# EAGLE design v4m (EAGLE 6.2)
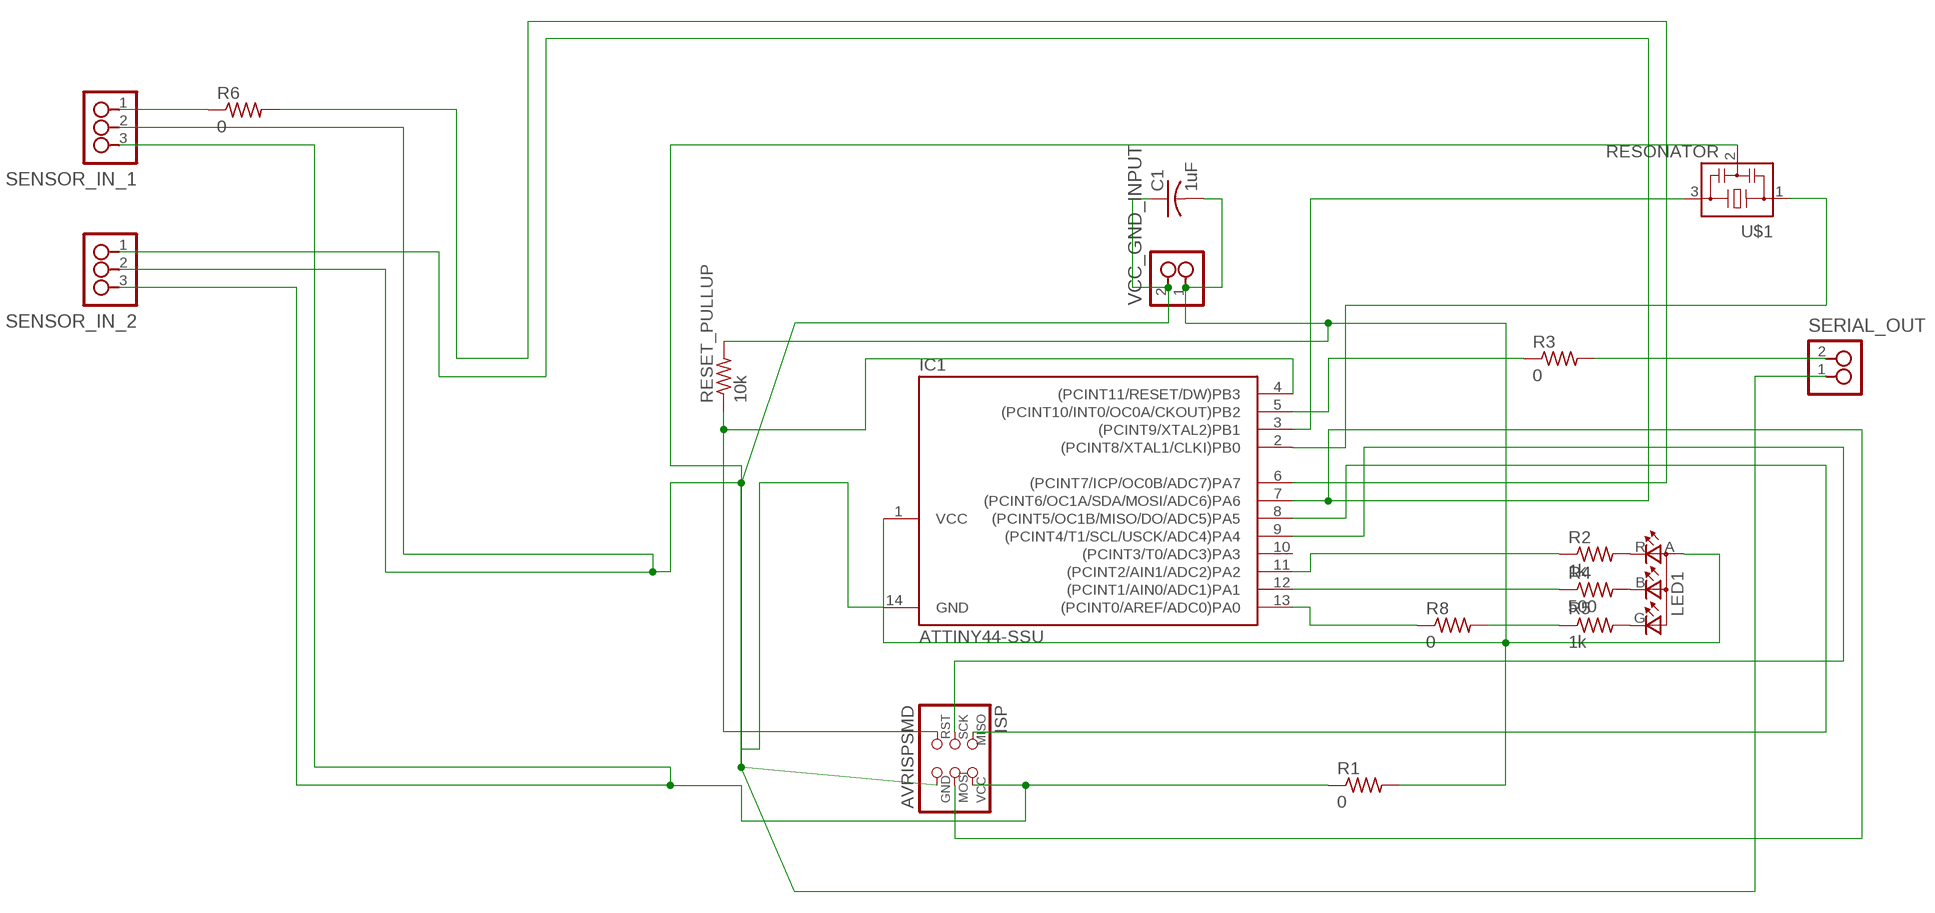
[diagram p0: schematic, sheet 1]

## Parts
C1  1uF  C-USC1206  [C1206]
IC1  ATTINY44-SSU  [SOIC14]
ISP  AVRISPSMD  [2X03SMD]
LED1  LEDRGBOLD  [P-LCC-4-3]
R1  0  RES-US1206  [R1206]
R2  1k  RES-US1206  [R1206]
R3  0  RES-US1206  [R1206]
R4  500  RES-US1206  [R1206]
R5  1k  RES-US1206  [R1206]
R6  0  RES-US1206  [R1206]
R8  0  RES-US1206  [R1206]
RESET_PULLUP  10k  R-US_R1206  [R1206]
SENSOR_IN_1  3_PIN_HEADERHEADER  [SMT_PINS_3]
SENSOR_IN_2  3_PIN_HEADERHEADER  [SMT_PINS_3]
SERIAL_OUT  2_PIN_HEADERHEADER  [SMT_PINS_2]
U$1  RESONATOR  [EFOBM]
VCC_GND_INPUT  2_PIN_HEADERHEADER  [SMT_PINS_2]

## Nets
ATTINY45: IC1.9((PCINT4/T1/SCL/USCK/ADC4)PA4) ISP.3(SCK)
N$2: C1.2 IC1.1(VCC) LED1.A(A2) R1.2 RESET_PULLUP.2 VCC_GND_INPUT.1
N$3: R5.1 R8.2
N$4: IC1.8((PCINT5/OC1B/MISO/DO/ADC5)PA5) ISP.1(MISO)
N$5: IC1.4((PCINT11/RESET/DW)PB3) ISP.5(RST) RESET_PULLUP.1
N$6: IC1.5((PCINT10/INT0/OC0A/CKOUT)PB2) R3.1
N$7: IC1.2((PCINT8/XTAL1/CLKI)PB0) U$1.1
N$8: ISP.2(VCC) R1.1 SENSOR_IN_1.3 SENSOR_IN_2.3
N$9: R6.1 SENSOR_IN_1.1
N$10: LED1.R(CRED) R2.2
N$11: LED1.B(CBLUE) R4.2
N$12: IC1.6((PCINT7/ICP/OC0B/ADC7)PA7) R6.2
N$13: IC1.3((PCINT9/XTAL2)PB1) U$1.3
N$14: LED1.G(CGREEN) R5.2
N$15: IC1.13((PCINT0/AREF/ADC0)PA0) R8.1
N$16: C1.1 IC1.14(GND) ISP.6(GND) SENSOR_IN_1.2 SENSOR_IN_2.2 SERIAL_OUT.1 U$1.2 VCC_GND_INPUT.2
N$17: IC1.11((PCINT2/AIN1/ADC2)PA2) R2.1
N$18: IC1.12((PCINT1/AIN0/ADC1)PA1) R4.1
N$19: R3.2 SERIAL_OUT.2
N$21: IC1.7((PCINT6/OC1A/SDA/MOSI/ADC6)PA6) ISP.4(MOSI) SENSOR_IN_2.1
Unconnected: IC1.10((PCINT3/T0/ADC3)PA3)

## Library data of the parts
C1 = resistor:C-US: CAPACITOR, American symbol
IC1 = fab:ATTINY44
ISP = fab:AVRISP
LED1 = fab:LEDRGBOLD: OSRAM Hyper Multi TOPLED® Hyper-Bright LED LATB T686 Source: http://www.osram.convergy.de/
R1-R6 R8 = fab:RES-US: Resistor (US Symbol) Variants with postfix FAB are widened to allow the routing of internal traces
RESET_PULLUP = resistor:R-US_: RESISTOR, American symbol
SENSOR_IN_1 SENSOR_IN_2 = ng:3_PIN_HEADER: 3 SMT pin pads
SERIAL_OUT VCC_GND_INPUT = ng:2_PIN_HEADER: 2 SMT pin pads
U$1 = fab:RESONATOR

## Board
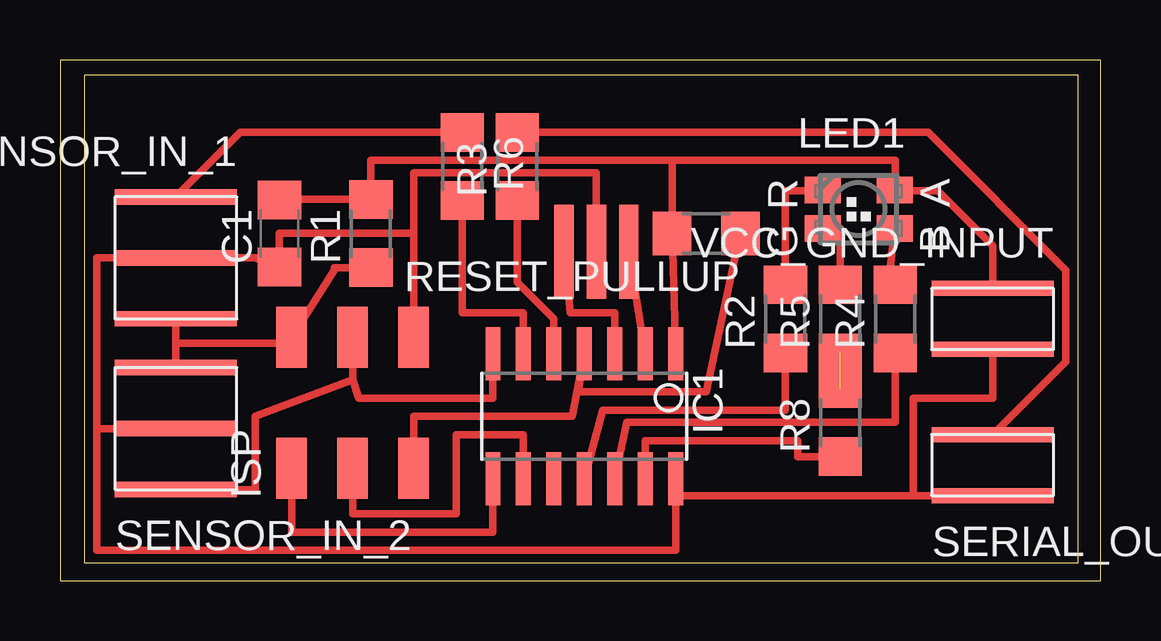
[diagram p1: board, top side]

Size 43.36 x 21.71 mm. Coordinates in mm from the lower left corner, seen from the top.
Outline: 0,0 43.36,0 43.36,21.71 0,21.71 0,0
Copper layers (1*16): Top 0.035mm / dielectric 1.5mm / Bottom 0.035mm
Design rules: minimum track width 10mil, minimum drill 24mil, track to track 8mil, track to pad 8mil, pad to pad 8mil, via to via 8mil, smd to smd 8mil, copper to edge 40mil, drill to drill 8mil, minimum pad ring 10mil, minimum via ring 8mil, stop-mask expansion 4mil, vias tented up to drill 0mil, thermal gap 10mil

### Footprints (pad centres in the part's own frame; a part is rotated, then mirrored left to right if it is on the bottom)
C1206 = smd 1.6 x 1.8: 1 -1.4,0; 2 1.4,0
SOIC14 = smd 0.61 x 2.21: 1 -3.81,-2.603; 2 -2.54,-2.603; 3 -1.27,-2.603; 4 0,-2.603; 5 1.27,-2.603; 6 2.54,-2.603; 7 3.81,-2.603; 8 3.81,2.603; 9 2.54,2.603; 10 1.27,2.603; 11 0,2.603; 12 -1.27,2.603; 13 -2.54,2.603; 14 -3.81,2.603
2X03SMD = smd 2.54 x 1.27: 1 -2.54,2.54; 2 2.92,2.54; 3 -2.54,0; 4 2.92,0; 5 -2.54,-2.54; 6 2.92,-2.54
P-LCC-4-3 = smd 1.1 x 1.5: A -0.8,1.5; B 0.8,1.5; G 0.8,-1.5; R -0.8,-1.5
R1206 = smd 1.6 x 1.803: 1 -1.422,0; 2 1.422,0
SMT_PINS_3 = smd 5.08 x 0.635: 1 0,0; 2 0,2.54; 3 0,5.08
SMT_PINS_2 = smd 5.08 x 0.635: 1 0,0; 2 0,2.54
EFOBM = smd 0.8 x 3.9: 1 -1.35,0; 2 0,0; 3 1.35,0

### Placement (x,y rotation side)
C1  9.14,14.48 90 top
IC1  21.84,6.86 180 top
ISP  12.19,7.24 90 top
LED1  33.27,15.49 270 top
R1  12.95,14.48 90 top
R2  30.23,10.92 90 top
R3  19.05,17.27 90 top
R4  34.8,10.92 90 top
R5  32.51,10.92 90 top
R6  16.76,17.27 270 top
R8  32.51,6.6 90 top
RESET_PULLUP  26.92,14.48 180 top
SENSOR_IN_1  4.83,16 180 top
SENSOR_IN_2  4.83,3.81 0 top
SERIAL_OUT  38.86,3.56 0 top
U$1  22.35,13.72 180 top
VCC_GND_INPUT  38.86,12.19 180 top

### Tracks (layer width: path | path; a pad name or v marks a point on that pad's centre or on a via)
ATTINY45
  Top 0.305: ISP.3 12.19,2.79 16.51,2.79 16.51,6.1 19.3,6.1 IC1.9
N$2
  Top 0.305: IC1.1 RESET_PULLUP.2 25.5,17.53 | 25.5,17.53 34.8,17.53 34.8,16.29 LED1.A 34.81,16.26 36.58,16.26 38.86,13.97 VCC_GND_INPUT.1 | 25.5,17.53 12.95,17.53 R1.2 9.14,15.9 C1.2
N$3  (1 unrouted)
N$4
  Top 0.305: ISP.1 9.65,2.03 18.03,2.03 IC1.8
N$5
  Top 0.305: ISP.5 14.73,6.86 21.34,6.86 IC1.4 21.59,7.87 26.92,7.87 RESET_PULLUP.1
N$6
  Top 0.305: IC1.5 20.57,10.92 19.05,12.45 R3.1
N$7
  Top 0.305: U$1.1 IC1.2
N$8
  Top 0.305: SENSOR_IN_2.3 4.83,9.91 | SENSOR_IN_1.3 4.83,9.91 | 4.83,9.91 9.14,9.91 ISP.2 11.43,12.95 11.43,13.06 R1.1
N$9
  Top 0.305: R6.1 7.52,18.69 SENSOR_IN_1.1
N$10
  Top 0.305: LED1.R 31.77,16.26 30.23,16.26 R2.2
N$11
  Top 0.305: LED1.B 34.52,12.34 R4.2
N$12
  Top 0.305: R6.2 16.76,11.18 19.3,11.18 IC1.6
N$13
  Top 0.305: U$1.3 21.26,11.18 23.11,11.18 IC1.3
N$14
  Top 0.305: R5.2 32.51,14.69 LED1.G
N$15
  Top 0.305: IC1.13 24.38,5.84 30.73,5.84 30.73,5.18 R8.1
N$16
  Top 0.305: 1.52,6.35 1.52,13.46 SENSOR_IN_1.2 8.13,13.46 C1.1 9.14,14.48 14.73,14.48 | 1.52,6.35 SENSOR_IN_2.2 | 35.56,3.56 25.65,3.56 IC1.14 25.65,1.27 1.52,1.27 1.52,6.35 | 35.56,3.56 SERIAL_OUT.1 | VCC_GND_INPUT.2 38.86,7.62 35.56,7.62 35.56,3.56 | ISP.6 14.73,14.48 | U$1.2 22.35,17.02 14.73,17.02 14.73,14.48
N$17
  Top 0.305: IC1.11 22.61,7.11 30.23,7.11 R2.1
N$18
  Top 0.305: R4.1 34.8,6.6 23.62,6.6 IC1.12
N$19
  Top 0.305: R3.2 36.17,18.69 41.91,12.95 41.91,9.14 SERIAL_OUT.2
N$21
  Top 0.305: SENSOR_IN_2.1 8.13,3.81 8.13,6.86 12.19,8.38 | ISP.4 12.19,8.38 | IC1.7 18.03,7.62 12.45,7.62 12.19,8.38